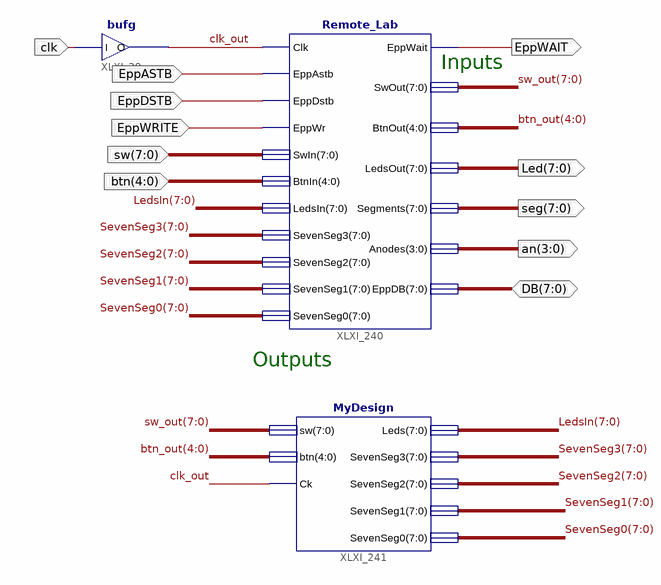
[diagram p0: schematic sheet 1]
// Xilinx ISE schematic top.sch (spartan6) as structural Verilog: 3 symbols, 11 ports
module top (
  input  EppASTB,
  input  EppDSTB,
  input  [7:0] sw,
  input  [4:0] btn,
  input  EppWRITE,
  input  clk,
  inout  [7:0] DB,
  output EppWAIT,
  output [7:0] Led,
  output [7:0] seg,
  output [3:0] an
);

  wire clk_out;
  wire [4:0] btn_out;
  wire [7:0] LedsIn, SevenSeg0, SevenSeg1, SevenSeg2, SevenSeg3, sw_out;

  Remote_Lab XLXI_240 (
    .Clk(clk_out), .EppAstb(EppASTB), .EppDstb(EppDSTB), .EppWr(EppWRITE), .SwIn(sw), .BtnIn(btn),
    .LedsIn(LedsIn), .SevenSeg3(SevenSeg3), .SevenSeg2(SevenSeg2), .SevenSeg1(SevenSeg1),
    .SevenSeg0(SevenSeg0), .EppWait(EppWAIT), .SwOut(sw_out), .BtnOut(btn_out), .LedsOut(Led),
    .Segments(seg), .Anodes(an), .EppDB(DB));
  bufg XLXI_29 (.I(clk), .O(clk_out));
  MyDesign XLXI_241 (
    .btn(btn_out), .Ck(clk_out), .Leds(LedsIn), .SevenSeg0(SevenSeg0), .SevenSeg1(SevenSeg1),
    .SevenSeg2(SevenSeg2), .SevenSeg3(SevenSeg3), .sw(sw_out));

  // Notes on the sheet:
  //   Inputs
  //   Outputs
endmodule
